# Altium schematic sheet Connectors.SchDoc
size A3
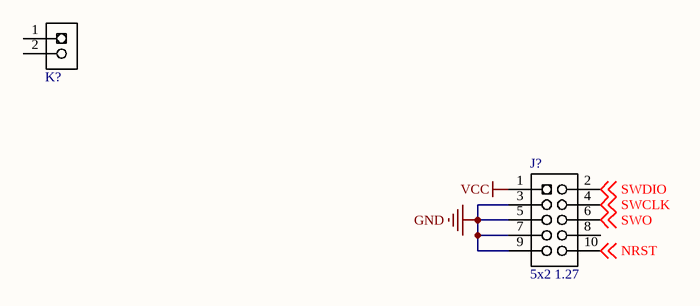
[diagram p0: Connectors.SchDoc]

## Parts
J?  5x2 1.27  [2x5 1.27mm]
K?  PLUGTERM5.08MM  [TERM2POS5.08]  (value not drawn)

## Nets
GND: J?.3(GND) J?.5(GND) J?.7(KEY) J?.9(GNDDetect)
VCC: J?.1(VCC)
NRST: J?.10(nRST) ; off-sheet NRST
SWCLK: J?.4(SWDCK/TCK) ; off-sheet SWCLK
SWDIO: J?.2(SWDIO/TMS) ; off-sheet SWDIO
SWO: J?.6(SWO/TDO) ; off-sheet SWO

Not connected (* = marked no-connect by the designer): J? 8(NC/TDI); K? 1 2

## Library data of the parts
J? = CORTEX 10 PIN: CORTEX 10 PIN 5x2 1.27mm
K? = PLUGTERM5.08MM: 2Pos Pluggable 5.08mm Terminal Block